# EAGLE design battery-nurse-1-2-1 (EAGLE 6.5.0)
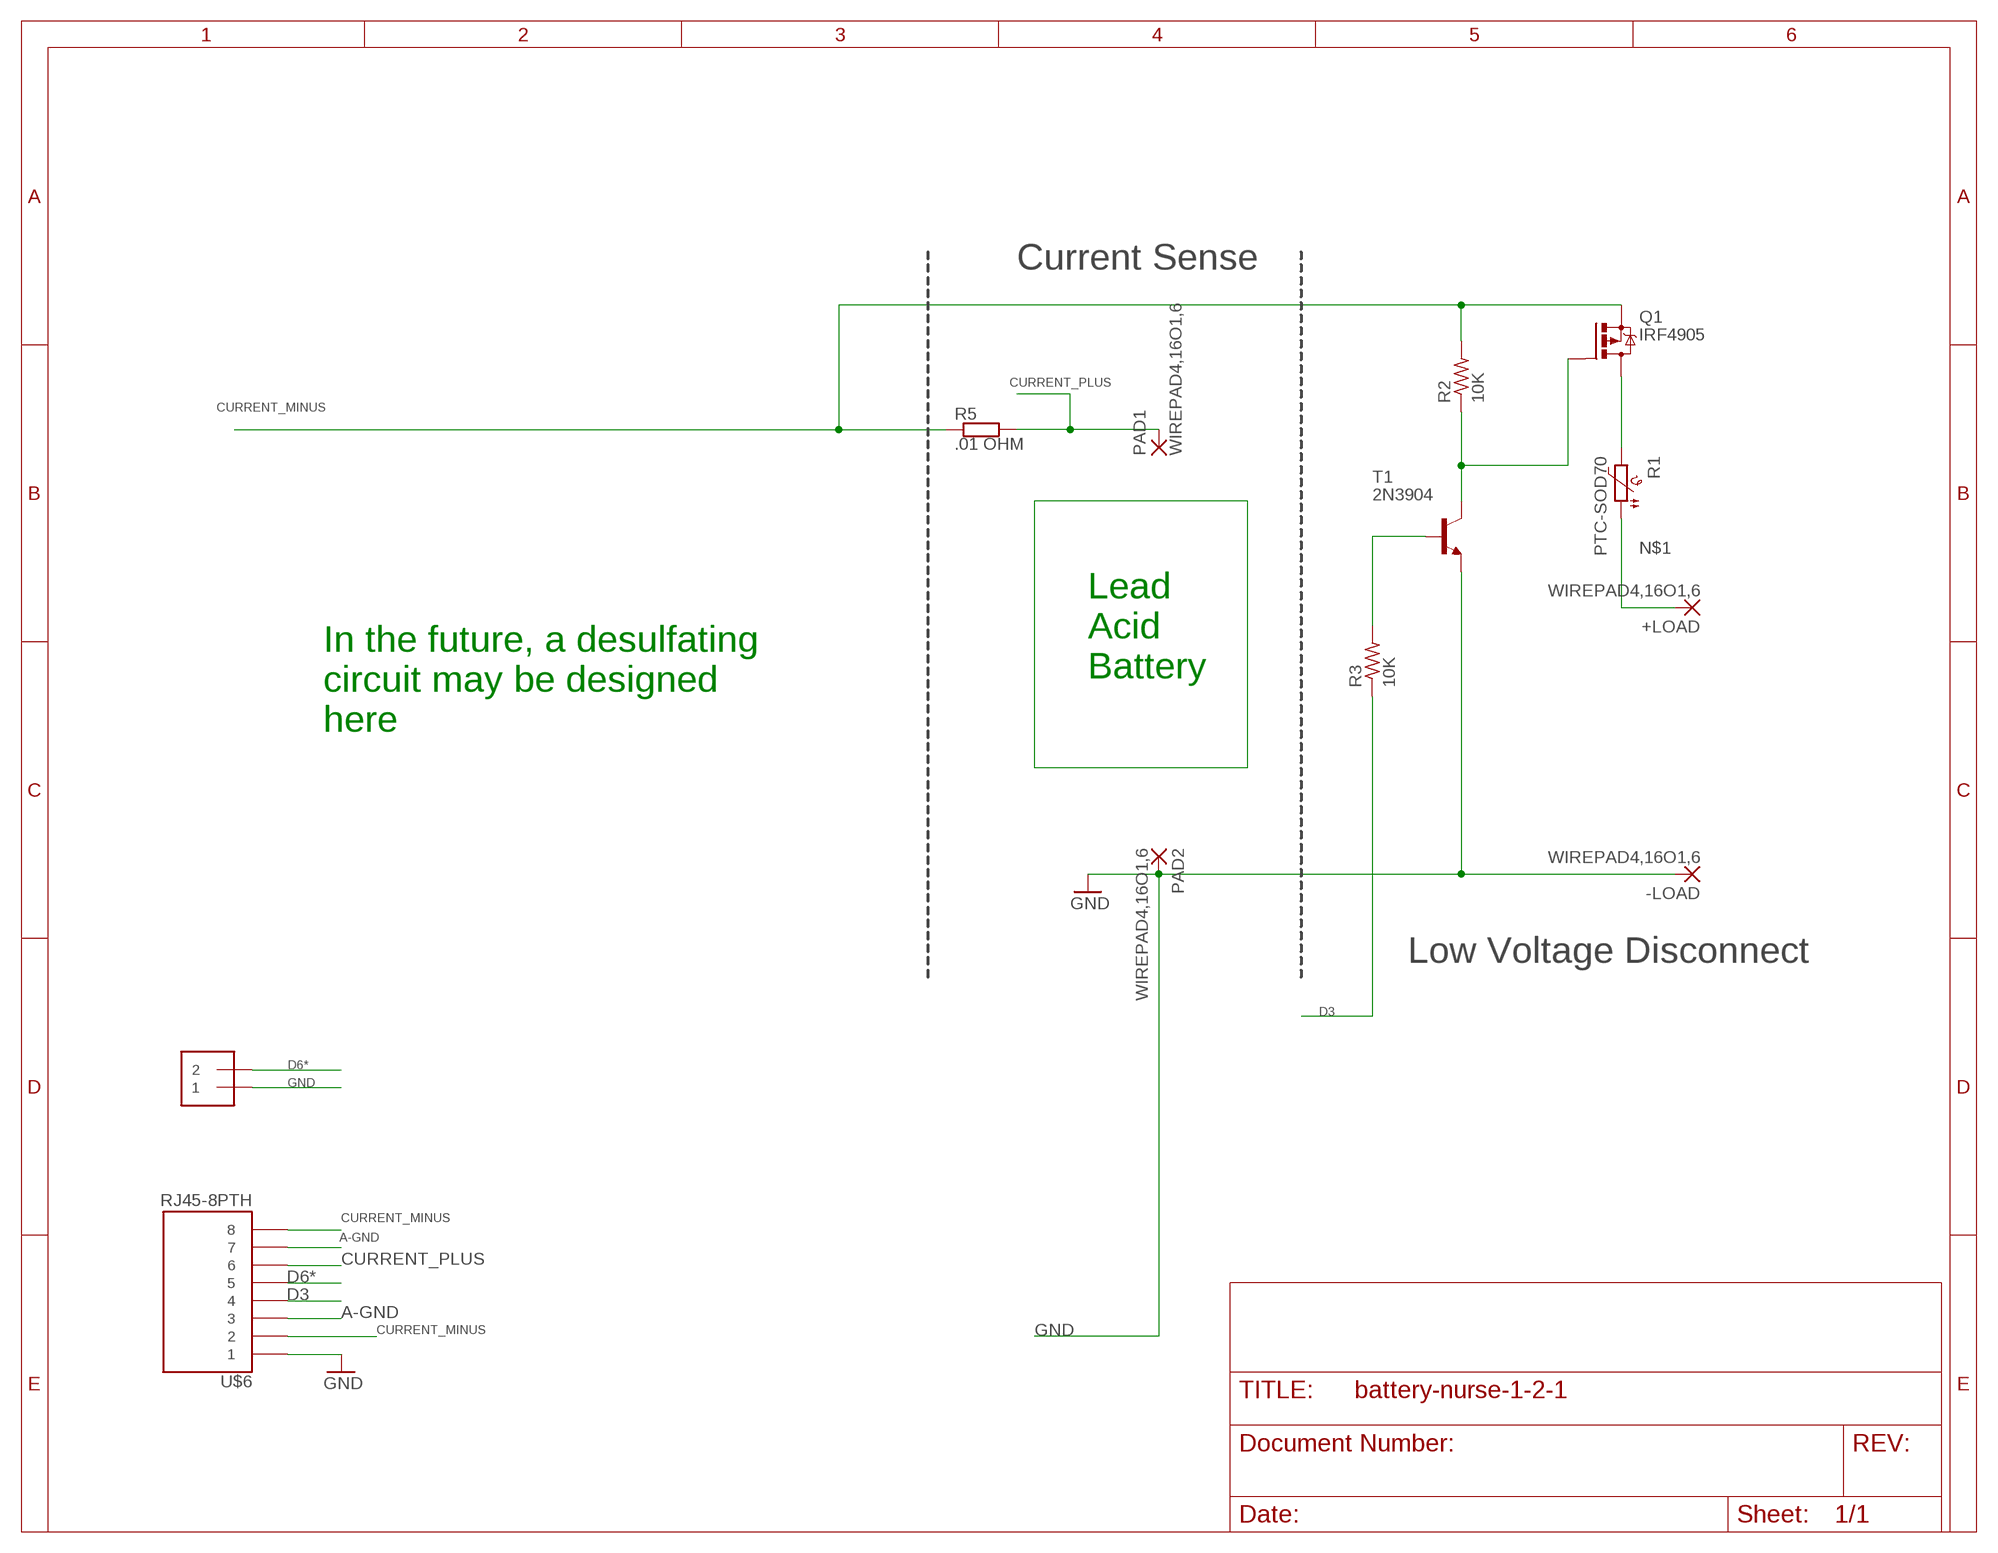
[diagram p0: schematic, sheet 1]

## Parts
+LOAD  WIREPAD4,16O1,6  [4,16O1,6]
-LOAD  WIREPAD4,16O1,6  [4,16O1,6]
J1  1X2-3.5MM  [1X2-3.5MM]
PAD1  WIREPAD4,16O1,6  [4,16O1,6]
PAD2  WIREPAD4,16O1,6  [4,16O1,6]
Q1  IRF4905  [TO220BH]
R1  PTC-SOD70  [SOD70]
R2  10K  R-US_0204/7  [0204/7]
R3  10K  R-US_0204/7  [0204/7]
R5  .01 OHM  SMT-REF  [SMT-REF]
T1  2N3904  2N2222  [TO92-EBC-OVAL]
U$6  RJ45-8PTH  [RJ45-8]

## Nets
A-GND: U$6.3 U$6.7
CURRENT_MINUS: Q1.S R2.2 R5.2 U$6.2 U$6.8
CURRENT_PLUS: PAD1.1(P) R5.1 U$6.6
D3: R3.1 U$6.4
D6*: J1.2 U$6.5
GND: -LOAD.1(P) J1.1 PAD2.1(P) T1.E U$6.1
N$1: +LOAD.1(P) R1.1
N$2: Q1.D R1.2
N$4: Q1.G R2.1 T1.C
N$9: R3.2 T1.B

## Notes on the sheet
- Current Sense
- Lead
  Acid
  Battery
- In the future, a desulfating
  circuit may be designed
  here
- Low Voltage Disconnect

## Library data of the parts
+LOAD -LOAD PAD1 PAD2 = wirepad:WIREPAD: Wire PAD connect wire on PCB
J1 = adafruit:1X2: 3.5mm Terminal block http://www.ladyada.net/library/pcb/eaglelibrary.html
Q1 = transistor-power:IRF4905: P-Channel HEXFET® Power MOSFET RDS(on)= 0.02 Ohm, ID = -74A Source: http://www.irf.com/product-info/datasheets/data/irf4905pbf.pdf
R1 = ptc-ntc:PTC-: Positive Temperature Coefficient Resistor (PTC) termistor Philips KTY81-210 - KTY81-252 Source: 153627-da-01-en-Temperatur-Sensor_KTY10-6_Philips.pdf; OC_FARNELL: unknown; OC_NEWARK: unknown
R2 R3 = rcl:R-US_: RESISTOR, American symbol
R5 = resistor-shunt:SMT-REF: SMD SHUNT RESISTOR; OC_FARNELL: unknown; OC_NEWARK: unknown
T1 = adafruit:2N2222: NPN TRANSISTOR Big oval pads
U$6 = SparkFun-Connectors:RJ45-8: RJ45 Jack Simple RJ45, 8-pin connection - connector for common Cat5, Cat5e, and Cat6 Ethernet cables. Footprint not yet proven in production. Connector sku is PRT-00643; Breakout PCB sku is BOB-00716.

## Net classes
0 default: width 0.203 mm, drill 0.406 mm, clearance 0.203 mm
1 power: width 0.203 mm, drill 0.406 mm, clearance 0.203 mm
2 gnd: width 0.203 mm, drill 0.406 mm, clearance 0.203 mm

## Board
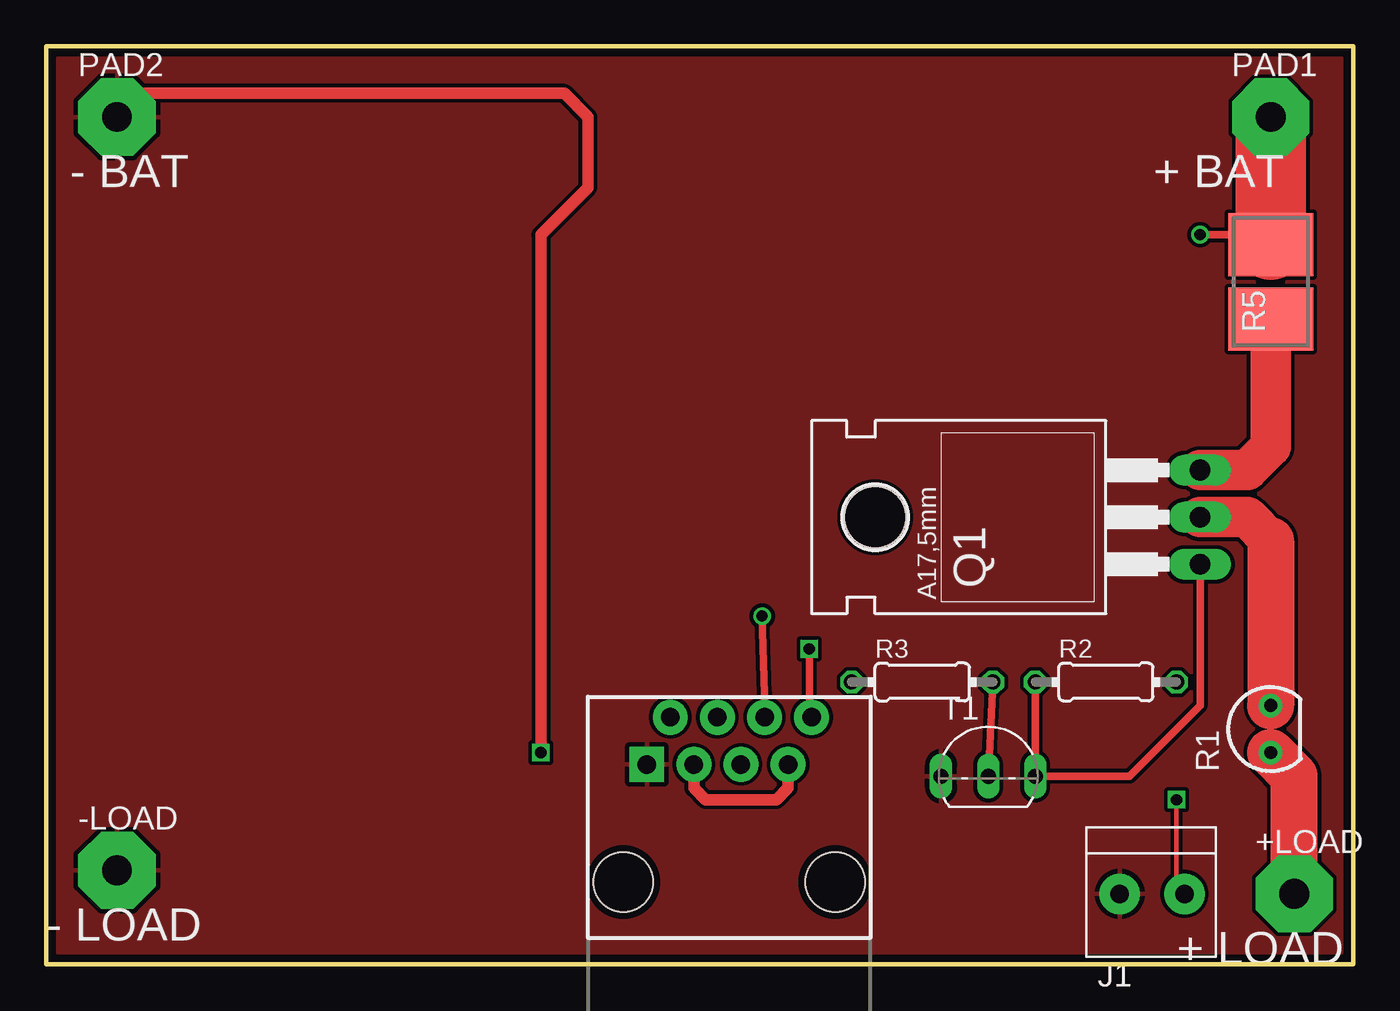
[diagram p1: board, top side]
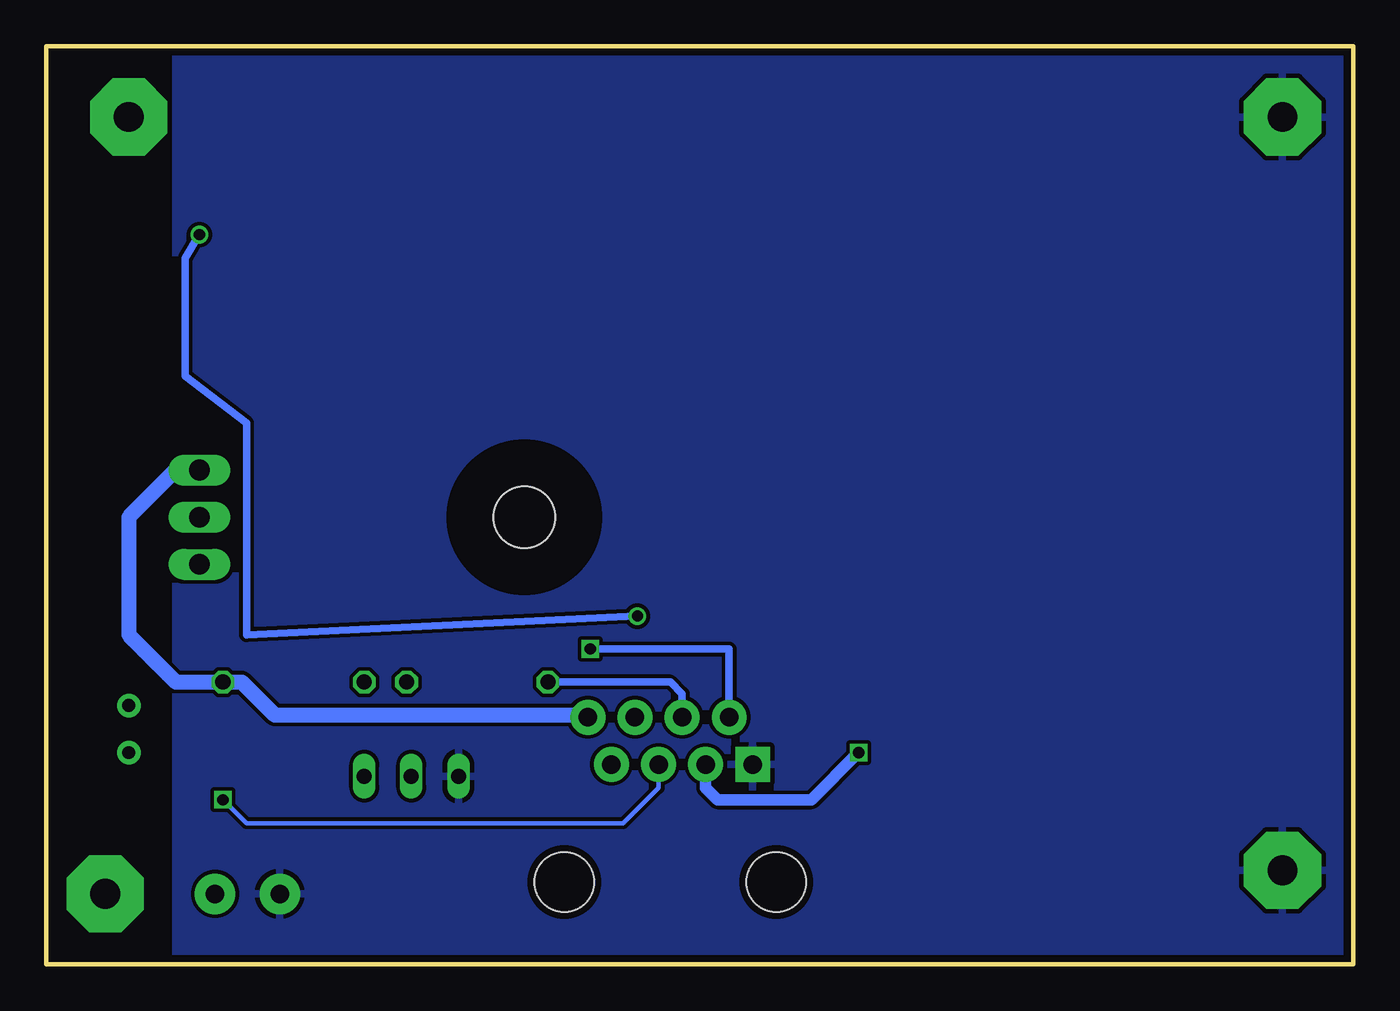
[diagram p2: board, bottom side, seen from below]

Size 70.48 x 49.53 mm. Coordinates in mm from the lower left corner, seen from the top.
Outline: 0,0 0,49.53 70.48,49.53 70.48,0 0,0
Copper layers (1*16): Top 0.0356mm / dielectric 1.5011mm / Bottom 0.0356mm
Design rules "LaenPCBOrder *": minimum track width 10mil, minimum drill 13mil, track to track 6mil, track to pad 6mil, pad to pad 6mil, via to via 6mil, smd to smd 6mil, copper to edge 15mil, drill to drill 6mil, minimum pad ring 7mil, minimum via ring 7mil, stop-mask expansion 4mil, vias tented up to drill 0mil, thermal gap 10mil

### Footprints (pad centres in the part's own frame; a part is rotated, then mirrored left to right if it is on the bottom)
4,16O1,6 = drill 1.6 pad 4.166 octagon: 1 0,0
1X2-3.5MM = drill 1 pad 2.184: 1 1.8,0; 2 -1.7,0
TO220BH = drill 1.118 long: D 0,-6.35; G -2.54,-6.35; S 2.54,-6.35 | hole 3.302: 0,11.176
SOD70 = drill 0.7 pad 1.27: 1 -1.27,0; 2 1.27,0
0204/7 = drill 0.813 octagon: 1 -3.81,0; 2 3.81,0
SMT-REF = smd 3.4 x 4.6: 1 2.007,0; 2 -2.007,0
TO92-EBC-OVAL = drill 0.813 long: B 0,-1.27; C 2.54,-1.27; E -2.54,-1.27
RJ45-8 = drill 1 pad 1.88 square: 1 -4.445,6.35 | drill 1 pad 1.88: 2 -3.175,8.89; 3 -1.905,6.35; 4 -0.635,8.89; 5 0.635,6.35; 6 1.905,8.89; 7 3.175,6.35; 8 4.445,8.89 | hole 3.2: -5.715,0; 5.715,0

### Placement (x,y rotation side)
+LOAD  67.31,3.81 0 top
-LOAD  3.81,5.08 0 top
J1  59.69,3.81 180 top
PAD1  66.04,45.72 0 top
PAD2  3.81,45.72 0 top
Q1  55.88,24.13 90 top
R1  66.04,12.7 90 top
R2  57.15,15.24 0 top
R3  47.24,15.24 0 top
R5  66.04,36.83 90 top
T1  50.8,11.43 0 top
U$6  36.83,4.45 0 top

### Tracks (layer width: path | path; a pad name or v marks a point on that pad's centre or on a via)
A-GND  (via drill 0.6)
  Top 0.61: 3.81,45.72 5.08,46.99 27.94,46.99 29.21,45.72 29.21,41.91 26.67,39.37 v26.67,11.43 | U$6.7 40.01,9.53 39.37,8.89 35.56,8.89 34.92,9.53 U$6.3
  Bottom 0.61: U$6.3 34.92,9.53 34.29,8.89 29.21,8.89 v26.67,11.43
CURRENT_MINUS  (via drill 0.6)
  Top 0.406: U$6.8 41.15,13.34 v41.15,17.02
  Top 2.184: Q1.S 64.77,26.67 66.04,27.94 R5.2
  Bottom 0.406: v41.15,17.02 33.66,17.02 U$6.2
  Bottom 0.813: Q1.S 63.5,26.67 66.04,24.13 66.04,17.78 63.5,15.24 R2.2 59.94,15.24 58.17,13.46 41.4,13.46 U$6.8
CURRENT_PLUS  (via drill 0.6)
  Top 0.406: U$6.6 38.73,14.61 v38.61,18.8 | v62.23,39.37 66.04,39.37
  Top 3.81: PAD1.1 66.04,39.37 R5.1
  Bottom 0.406: v38.61,18.8 59.69,17.78 59.69,29.21 62.99,31.75 62.99,38.1 v62.23,39.37
D3
  Bottom 0.406: U$6.4 36.2,14.61 36.83,15.24 R3.1
D6*  (via drill 0.6)
  Top 0.254: v60.96,8.89 60.96,4.24 J1.2
  Bottom 0.254: U$6.5 37.47,9.53 39.37,7.62 59.69,7.62 v60.96,8.89
GND
  pour Bottom: 0,0 0,49.53 63.5,49.53 63.5,0
  pour Top (rank 6): 0.64,48.9 69.85,48.9 69.85,0.64 0.64,0.64
N$1
  Top 2.54: +LOAD.1 67.31,10.16 R1.1
N$2
  Top 2.184: Q1.D 64.77,24.13 66.04,22.86
  Top 2.54: 66.04,22.86 R1.2
N$4
  Top 0.406: Q1.G 62.23,13.97 58.42,10.16 T1.C R2.1
N$9
  Top 0.406: T1.B R3.2

### Text on the board
tPlace: - BAT | + BAT | - LOAD | + LOAD
tValues: Version 1.2.1